# EAGLE design IC Adapter 2x20 (EAGLE 9.6.2)
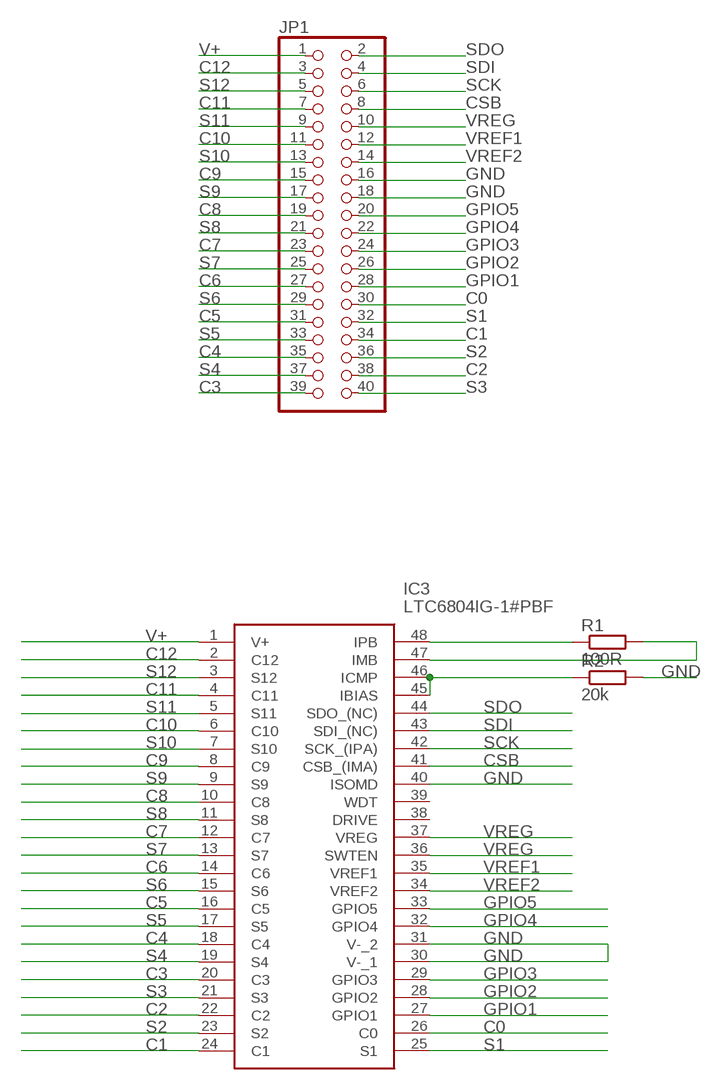
[diagram p0: schematic, sheet 1]

## Parts
IC3  LTC6804IG-1#PBF  [SOP50P780X200-48N]
JP1  PINHD-2X20  [2X20]
R1  100R  R-EU_R0805  [R0805]
R2  20k  R-EU_R0805  [R0805]

## Nets
C0: IC3.26(C0) JP1.30
C1: IC3.24(C1) JP1.34
C2: IC3.22(C2) JP1.38
C3: IC3.20(C3) JP1.39
C4: IC3.18(C4) JP1.35
C5: IC3.16(C5) JP1.31
C6: IC3.14(C6) JP1.27
C7: IC3.12(C7) JP1.23
C8: IC3.10(C8) JP1.19
C9: IC3.8(C9) JP1.15
C10: IC3.6(C10) JP1.11
C11: IC3.4(C11) JP1.7
C12: IC3.2(C12) JP1.3
CSB: IC3.41(CSB_(IMA)) JP1.8
GND: IC3.30(V-_1) IC3.31(V-_2) IC3.40(ISOMD) JP1.16 JP1.18 R2.2
GPIO1: IC3.27(GPIO1) JP1.28
GPIO2: IC3.28(GPIO2) JP1.26
GPIO3: IC3.29(GPIO3) JP1.24
GPIO4: IC3.32(GPIO4) JP1.22
GPIO5: IC3.33(GPIO5) JP1.20
ICMP: IC3.45(IBIAS) IC3.46(ICMP) R2.1
N$1: IC3.48(IPB) R1.1
N$2: IC3.47(IMB) R1.2
S1: IC3.25(S1) JP1.32
S2: IC3.23(S2) JP1.36
S3: IC3.21(S3) JP1.40
S4: IC3.19(S4) JP1.37
S5: IC3.17(S5) JP1.33
S6: IC3.15(S6) JP1.29
S7: IC3.13(S7) JP1.25
S8: IC3.11(S8) JP1.21
S9: IC3.9(S9) JP1.17
S10: IC3.7(S10) JP1.13
S11: IC3.5(S11) JP1.9
S12: IC3.3(S12) JP1.5
SCK: IC3.42(SCK_(IPA)) JP1.6
SDI: IC3.43(SDI_(NC)) JP1.4
SDO: IC3.44(SDO_(NC)) JP1.2
V+: IC3.1(V+) JP1.1
VREF1: IC3.35(VREF1) JP1.12
VREF2: IC3.34(VREF2) JP1.14
VREG: IC3.36(SWTEN) IC3.37(VREG) JP1.10
Unconnected: IC3.38(DRIVE) IC3.39(WDT)

## Library data of the parts
IC3 = SamacSys_Parts:LTC6804IG-1#PBF: Multicell Battery Monitors, 0V - 5V Source: Datasheet <http://cds.linear.com/docs/en/datasheet/680412fb.pdf>; DESCRIPTION: Multicell Battery Monitors, 0V - 5V; HEIGHT: 2mm; MANUFACTURER_NAME: Linear Technology; MANUFACTURER_PART_NUMBER: LTC6804IG-1#PBF; MOUSER_PART_NUMBER: 584-LTC6804IG-1#PBF; MOUSER_PRICE-STOCK: https://www.mouser.co.uk/ProductDetail/Analog-Devices-Linear-Technology/LTC6804IG-1PBF?qs=hVkxg5c3xu%2FdtwBTq6c3xw%3D%3D
JP1 = pinhead:PINHD-2X20: PIN HEADER
R1 R2 = rcl:R-EU_: RESISTOR, European symbol

## Board
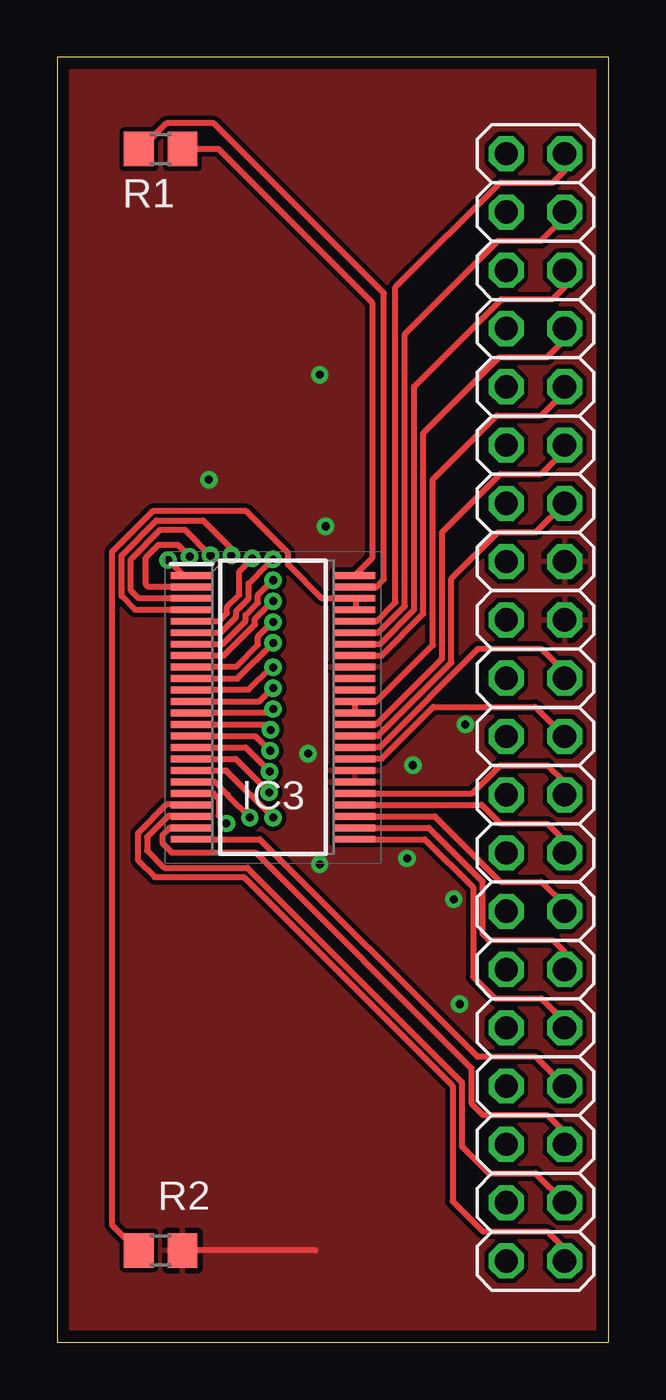
[diagram p1: board, top side]
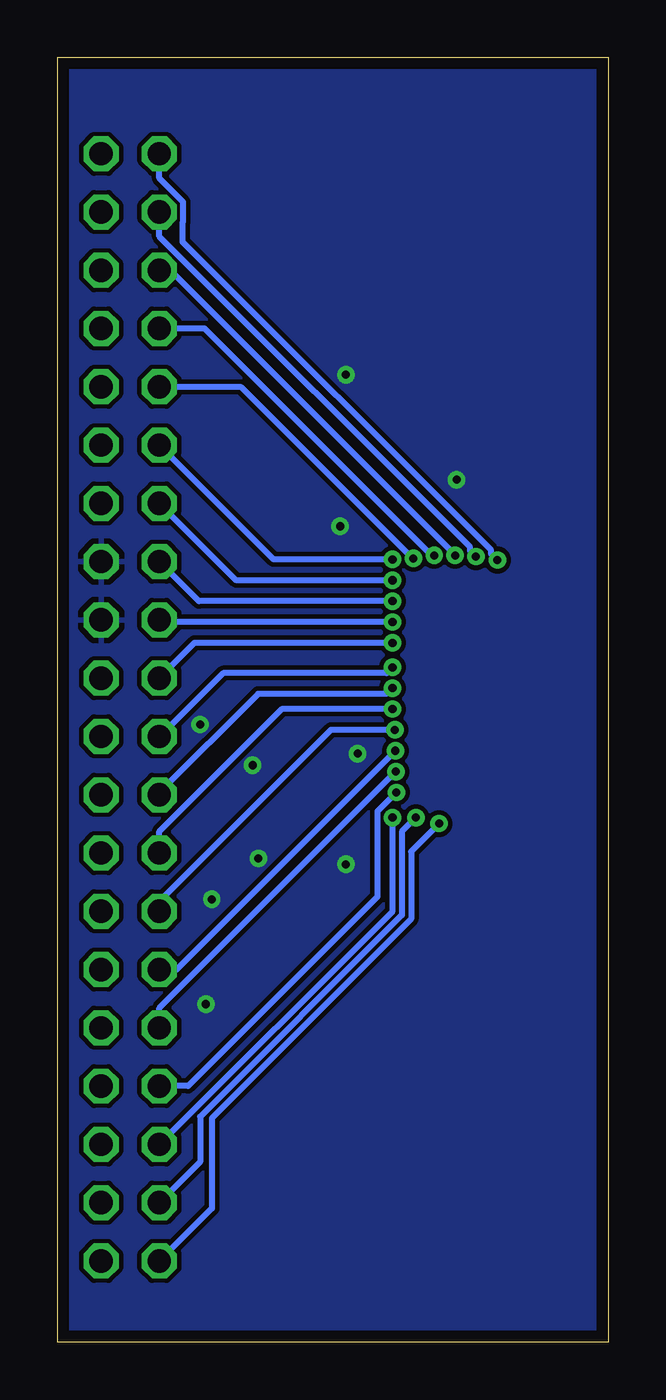
[diagram p2: board, bottom side, seen from below]

Size 24 x 56 mm. Coordinates in mm from the lower left corner, seen from the top.
Outline: 0,0 24,0 24,56 0,56 0,0
Copper layers (1*16): Top 0.07mm / dielectric 1.5mm / Bottom 0.07mm
Design rules "default *": minimum track width 10mil, minimum drill 0.35mm, track to track 6mil, track to pad 6mil, pad to pad 6mil, via to via 6mil, smd to smd 6mil, copper to edge 20mil, drill to drill 6mil, minimum pad ring 10mil, minimum via ring 8mil, stop-mask expansion 4mil, vias tented up to drill 0mil, thermal gap 10mil

### Footprints (pad centres in the part's own frame; a part is rotated, then mirrored left to right if it is on the bottom)
SOP50P780X200-48N = smd 1.8 x 0.3: 1 -3.55,5.75; 2 -3.55,5.25; 3 -3.55,4.75; 4 -3.55,4.25; 5 -3.55,3.75; 6 -3.55,3.25; 7 -3.55,2.75; 8 -3.55,2.25; 9 -3.55,1.75; 10 -3.55,1.25; 11 -3.55,0.75; 12 -3.55,0.25; 13 -3.55,-0.25; 14 -3.55,-0.75; 15 -3.55,-1.25; 16 -3.55,-1.75; 17 -3.55,-2.25; 18 -3.55,-2.75; 19 -3.55,-3.25; 20 -3.55,-3.75; 21 -3.55,-4.25; 22 -3.55,-4.75; 23 -3.55,-5.25; 24 -3.55,-5.75; 25 3.55,-5.75; 26 3.55,-5.25; 27 3.55,-4.75; 28 3.55,-4.25; 29 3.55,-3.75; 30 3.55,-3.25; 31 3.55,-2.75; 32 3.55,-2.25; 33 3.55,-1.75; 34 3.55,-1.25; 35 3.55,-0.75; 36 3.55,-0.25; 37 3.55,0.25; 38 3.55,0.75; 39 3.55,1.25; 40 3.55,1.75; 41 3.55,2.25; 42 3.55,2.75; 43 3.55,3.25; 44 3.55,3.75; 45 3.55,4.25; 46 3.55,4.75; 47 3.55,5.25; 48 3.55,5.75
2X20 = drill 1.016 octagon: 1 -24.13,-1.27; 2 -24.13,1.27; 3 -21.59,-1.27; 4 -21.59,1.27; 5 -19.05,-1.27; 6 -19.05,1.27; 7 -16.51,-1.27; 8 -16.51,1.27; 9 -13.97,-1.27; 10 -13.97,1.27; 11 -11.43,-1.27; 12 -11.43,1.27; 13 -8.89,-1.27; 14 -8.89,1.27; 15 -6.35,-1.27; 16 -6.35,1.27; 17 -3.81,-1.27; 18 -3.81,1.27; 19 -1.27,-1.27; 20 -1.27,1.27; 21 1.27,-1.27; 22 1.27,1.27; 23 3.81,-1.27; 24 3.81,1.27; 25 6.35,-1.27; 26 6.35,1.27; 27 8.89,-1.27; 28 8.89,1.27; 29 11.43,-1.27; 30 11.43,1.27; 31 13.97,-1.27; 32 13.97,1.27; 33 16.51,-1.27; 34 16.51,1.27; 35 19.05,-1.27; 36 19.05,1.27; 37 21.59,-1.27; 38 21.59,1.27; 39 24.13,-1.27; 40 24.13,1.27
R0805 = smd 1.3 x 1.5: 1 -0.95,0; 2 0.95,0

### Placement (x,y rotation side)
IC3  9.4,27.67 0 top
JP1  20.83,27.67 270 top
R1  4.5,52 180 top
R2  4.5,4 0 top

### Tracks (layer width: path | path; a pad name or v marks a point on that pad's centre or on a via)
C0
  Top 0.254: JP1.30 22.1,17.02 21.59,17.53 18.79,17.53 18.52,17.8 18.52,20.09 16.19,22.42 IC3.26
C1
  Top 0.254: IC3.24 8.81,21.92 18.29,12.45 20.83,12.45 22.1,11.18 JP1.34
C2
  Top 0.254: IC3.22 4.83,22.93 3.91,22.01 3.91,21.42 4.66,20.68 8.28,20.68 17.63,11.33 17.63,8.53 18.8,7.37 20.83,7.37 22.1,6.1 JP1.38
C3  (via drill 0.35)
  Top 0.254: v7.37,22.61 7.03,22.95 7.03,23.69 6.79,23.92 IC3.20
  Bottom 0.254: v7.37,22.61 8.59,21.39 8.59,18.44 17.27,9.76 17.27,5.83 JP1.39
C4  (via drill 0.35)
  Top 0.254: IC3.18 7.34,24.92 v9.4,22.86
  Bottom 0.254: JP1.35 9.4,18.78 v9.4,22.86
C5  (via drill 0.35)
  Top 0.254: IC3.16 8.2,25.92 v9.25,24.87
  Bottom 0.254: JP1.31 19.56,14.56 v9.25,24.87
C6  (via drill 0.35)
  Top 0.254: IC3.14 9.06,26.92 v9.29,26.69
  Bottom 0.254: v9.29,26.69 12.09,26.69 19.56,19.21 JP1.27
C7  (via drill 0.35)
  Top 0.254: IC3.12 8.79,27.92 9.13,28.25 9.15,28.25 v9.4,28.5
  Bottom 0.254: v9.4,28.5 9.65,28.25 15.26,28.25 19.56,23.95 JP1.23
C8  (via drill 0.35)
  Top 0.254: v9.4,30.48 7.84,28.93 IC3.10
  Bottom 0.254: JP1.19 19.56,28.96 18.03,30.48 v9.4,30.48
C9  (via drill 0.35)
  Top 0.254: IC3.8 7.25,29.92 8.61,31.27 8.61,31.53 9.13,32.05 9.15,32.05 v9.4,32.3
  Bottom 0.254: v9.4,32.3 17.84,32.3 JP1.15
C10  (via drill 0.35)
  Top 0.254: v9.4,34.12 9.15,33.86 9.13,33.86 8.33,33.07 8.33,32.4 7.79,31.86 7.79,31.61 7.1,30.91 IC3.6
  Bottom 0.254: v9.4,34.12 14.57,34.12 JP1.11
C11  (via drill 0.35)
  Top 0.254: IC3.4 3.39,31.92 2.79,32.51 2.79,34.29 4.32,35.81 6.35,35.81 7.58,34.58 v7.58,34.29
  Bottom 0.254: v7.58,34.29 7.69,34.29 17.58,44.18 JP1.7
C12  (via drill 0.35)
  Top 0.254: IC3.2 3.96,32.92 3.86,33.02 3.86,34.21 4.4,34.75 5.26,34.75 5.4,34.61 v5.76,34.24
  Bottom 0.254: v5.76,34.24 6.01,34.49 6.01,34.65 19.56,48.19 JP1.3
CSB
  Top 0.254: IC3.41 14.11,29.91 15.95,31.75 15.95,39.62 19.25,42.93 21.34,42.93 22.1,43.69 JP1.8
GND  (via drill 0.35)
  Top 0.254: 11.25,4 R2.2 | 13,24.88 IC3.31
  Bottom 0.254: 22.04,31.38 JP1.18
  other vias: 11.68,35.56 11.43,20.83 17.53,14.73 15.49,25.15 17.78,26.92 6.6,37.59 11.43,42.16 15.24,21.08 17.27,19.3 10.92,25.65
  pour Top (isolate 0.2): 0,55.88 24.13,55.88 24.13,0 0,0
  pour Bottom (isolate 0.2): 0,55.88 24.13,55.88 24.13,0 -0.25,0
GPIO1
  Top 0.254: IC3.27 16.45,22.92 19.3,20.07 21.08,20.07 22.1,19.05 JP1.28
GPIO2
  Top 0.254: IC3.28 18.49,23.42 19.3,22.61 21.34,22.61 22.1,21.84 JP1.26
GPIO3
  Top 0.254: IC3.29 18.08,23.92 19.3,25.15 21.34,25.15 22.1,24.38 JP1.24
GPIO4
  Top 0.254: IC3.32 12.97,25.44 14.14,25.44 16.38,27.69 20.81,27.69 JP1.22
GPIO5
  Top 0.254: IC3.33 12.97,25.94 14.06,25.94 18.35,30.23 21.08,30.23 22.1,29.21 JP1.20
ICMP
  Top 0.254: R2.1 3.5,4 2.38,5.12 2.38,34.45 4.15,36.22 8.22,36.22 10.06,34.39 10.06,33.89 11.52,32.42 IC3.46 13,32.38 13,32 IC3.45
N$1
  Top 0.254: R1.1 7.02,52 13.71,45.31 13.71,34.18 IC3.48
N$2
  Top 0.254: R1.2 3.62,52 4.75,53.12 6.82,53.12 14.22,45.72 14.22,33.25 13.86,32.89 12.98,32.89 IC3.47
S1
  Top 0.254: JP1.32 22.1,13.97 21.08,14.99 19.05,14.99 18.11,15.93 18.11,19.81 16,21.92 IC3.25
S2
  Top 0.254: IC3.23 4.89,22.42 4.57,22.1 4.57,21.75 4.99,21.34 8.64,21.34 18.03,11.94 18.03,10.41 18.54,9.91 21.34,9.91 22.1,9.14 JP1.36
S3
  Top 0.254: IC3.21 4.75,23.43 3.5,22.18 3.5,21 4.24,20.27 8.11,20.27 17.22,11.16 17.22,6.15 18.54,4.83 21.34,4.83 22.1,4.06 JP1.40
S4  (via drill 0.35)
  Top 0.254: v8.38,22.86 7.43,23.81 7.43,23.85 6.87,24.42 IC3.19
  Bottom 0.254: v8.38,22.86 8.99,22.25 8.99,18.61 17.78,9.82 17.78,7.86 JP1.37
S5  (via drill 0.35)
  Top 0.254: IC3.17 7.77,25.42 v9.23,23.96
  Bottom 0.254: v9.23,23.96 10.06,23.13 10.06,19.41 18.3,11.16 JP1.33
S6  (via drill 0.35)
  Top 0.254: IC3.15 8.63,26.42 v9.27,25.78
  Bottom 0.254: v9.27,25.78 18.81,16.24 JP1.29
S7  (via drill 0.35)
  Top 0.254: v9.4,27.59 9.25,27.59 9.1,27.44 5.87,27.44 IC3.13
  Bottom 0.254: JP1.25 19.56,22.26 14.22,27.59 v9.4,27.59
S8  (via drill 0.35)
  Top 0.254: IC3.11 5.87,28.44 8.34,28.44 9.31,29.41 v9.4,29.41
  Bottom 0.254: v9.4,29.41 9.65,29.16 16.78,29.16 19.54,26.4 JP1.21
S9  (via drill 0.35)
  Top 0.254: IC3.9 5.87,29.44 7.78,29.44 8.74,30.4 8.74,30.75 9.13,31.14 9.15,31.14 v9.4,31.39
  Bottom 0.254: v9.4,31.39 19.47,31.39 JP1.17
S10  (via drill 0.35)
  Top 0.254: IC3.7 7.17,30.41 8.2,31.44 8.2,31.7 8.74,32.24 8.74,32.57 9.13,32.95 9.15,32.95 v9.4,33.21
  Bottom 0.254: v9.4,33.21 16.2,33.21 JP1.13
S11  (via drill 0.35)
  Top 0.254: IC3.5 7.02,31.41 7.39,31.78 7.39,32.03 7.93,32.57 7.93,33.6 v8.49,34.16
  Bottom 0.254: JP1.9 19.54,41.62 15.98,41.62 8.51,34.16 v8.49,34.16
S12  (via drill 0.35)
  Top 0.254: IC3.3 3.55,32.42 3.2,32.77 3.2,34.12 4.49,35.41 5.55,35.41 v6.67,34.29
  Bottom 0.254: v6.67,34.29 6.92,34.54 6.92,34.56 19.08,46.72 JP1.5
SCK
  Top 0.254: IC3.42 14.04,30.41 15.54,31.92 15.54,41.66 19.36,45.47 21.59,45.47 22.1,45.97 JP1.6
SDI
  Top 0.254: IC3.43 13.96,30.92 15.14,32.09 15.14,43.94 19.2,48.01 21.08,48.01 22.1,49.02 JP1.4
SDO
  Top 0.254: IC3.44 13.89,31.41 14.73,32.26 14.73,45.97 19.3,50.55 21.59,50.55 22.1,51.05 JP1.2
V+  (via drill 0.35)
  Top 0.254: IC3.1 5.5,33.42 v4.83,34.09
  Bottom 0.254: v4.83,34.09 5.11,34.37 5.11,34.51 18.54,47.95 18.54,48.8 18.52,48.83 18.52,49.69 19.56,50.73 JP1.1
VREF1
  Top 0.254: IC3.35 12.97,26.94 13.91,26.94 16.76,29.79 16.76,35.31 19.3,37.85 21.08,37.85 22.1,38.86 JP1.12
VREF2
  Top 0.254: IC3.34 13.96,26.42 17.17,29.62 17.17,33.27 19.2,35.31 20.84,35.31 JP1.14
VREG
  Top 0.254: IC3.36 IC3.37 13.89,27.91 16.36,30.38 16.36,37.59 19.15,40.39 21.08,40.39 22.1,41.4 JP1.10